# EAGLE design GMO-00058 (EAGLE 5.11)
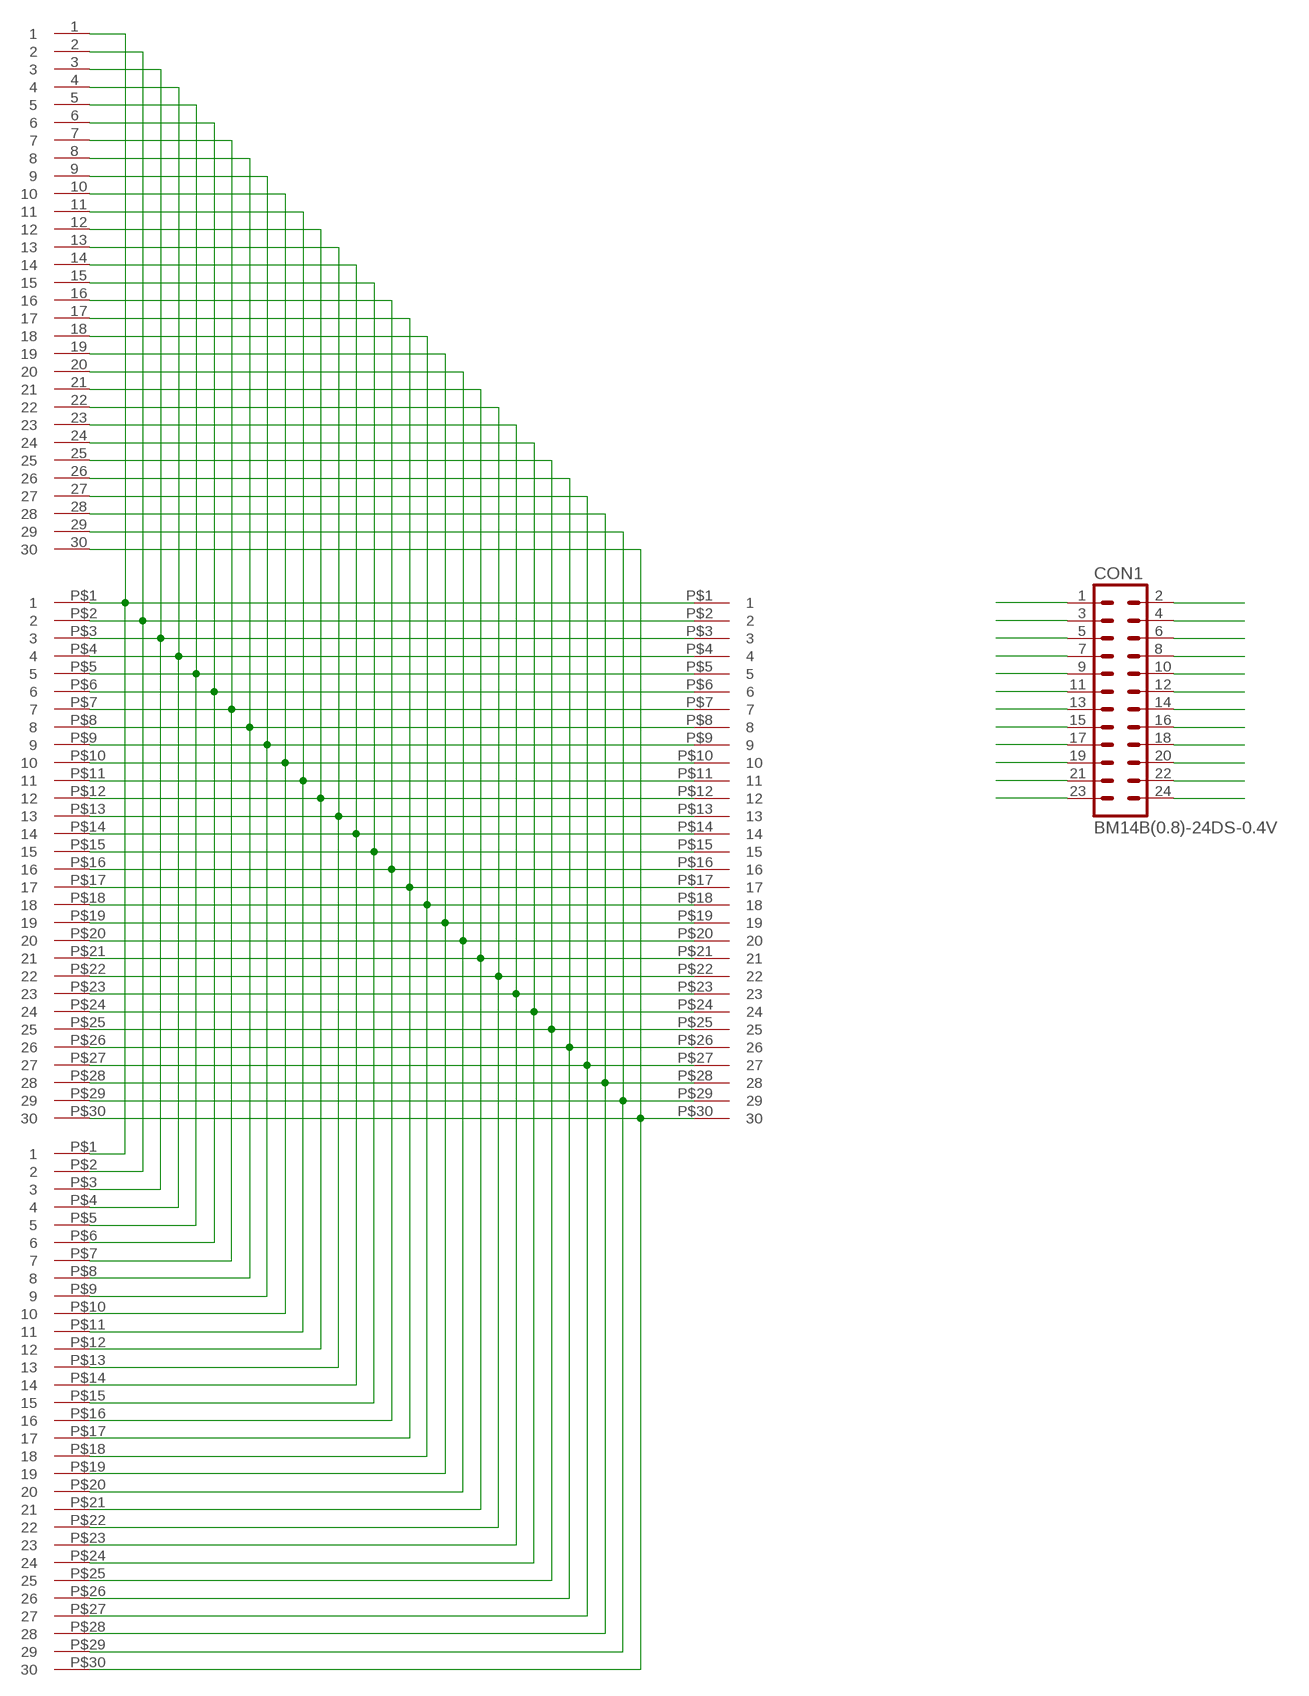
[diagram p0: schematic, sheet 1]

## Parts
CON1  BM14B(0.8)-24DS-0.4V  [BM14(0.8)-24DS-0.4V]
U$1  LCD-30PIN-15X2-PTH-BREADBOARD  [15X2-PTH-BREADBOARD]
U$2  LCD-30PIN-FPC-30-0.65  [FPC-30-0.65]
U$3  LCD-30PIN-FPC-30-1.00  [FPC-30-1.00]
U$4  LCD-30PIN-FPC-30-0.70  [FPC-30-0.70]

## Nets
N$1: CON1.1 U$1.P$1 U$2.P$1 U$3.P$1 U$4.1
N$2: CON1.2 U$1.P$2 U$2.P$2 U$3.P$2 U$4.2
N$3: CON1.3 U$1.P$3 U$2.P$3 U$3.P$3 U$4.3
N$4: CON1.4 U$1.P$4 U$2.P$4 U$3.P$4 U$4.4
N$5: CON1.5 U$1.P$5 U$2.P$5 U$3.P$5 U$4.5
N$6: CON1.6 U$1.P$6 U$2.P$6 U$3.P$6 U$4.6
N$7: CON1.7 U$1.P$7 U$2.P$7 U$3.P$7 U$4.7
N$8: CON1.8 U$1.P$8 U$2.P$8 U$3.P$8 U$4.8
N$9: CON1.9 U$1.P$9 U$2.P$9 U$3.P$9 U$4.9
N$10: CON1.10 U$1.P$10 U$2.P$10 U$3.P$10 U$4.10
N$11: CON1.11 U$1.P$11 U$2.P$11 U$3.P$11 U$4.11
N$12: CON1.12 U$1.P$12 U$2.P$12 U$3.P$12 U$4.12
N$13: CON1.13 U$1.P$13 U$2.P$13 U$3.P$13 U$4.13
N$14: CON1.14 U$1.P$14 U$2.P$14 U$3.P$14 U$4.14
N$15: CON1.15 U$1.P$15 U$2.P$15 U$3.P$15 U$4.15
N$16: CON1.16 U$1.P$16 U$2.P$16 U$3.P$16 U$4.16
N$17: CON1.17 U$1.P$17 U$2.P$17 U$3.P$17 U$4.17
N$18: CON1.18 U$1.P$18 U$2.P$18 U$3.P$18 U$4.18
N$19: CON1.19 U$1.P$19 U$2.P$19 U$3.P$19 U$4.19
N$20: CON1.20 U$1.P$20 U$2.P$20 U$3.P$20 U$4.20
N$21: CON1.21 U$1.P$21 U$2.P$21 U$3.P$21 U$4.21
N$22: CON1.22 U$1.P$22 U$2.P$22 U$3.P$22 U$4.22
N$23: CON1.23 U$1.P$23 U$2.P$23 U$3.P$23 U$4.23
N$24: CON1.24 U$1.P$24 U$2.P$24 U$3.P$24 U$4.24
N$25: U$1.P$25 U$2.P$25 U$3.P$25 U$4.25
N$26: U$1.P$26 U$2.P$26 U$3.P$26 U$4.26
N$27: U$1.P$27 U$2.P$27 U$3.P$27 U$4.27
N$28: U$1.P$28 U$2.P$28 U$3.P$28 U$4.28
N$29: U$1.P$29 U$2.P$29 U$3.P$29 U$4.29
N$30: U$1.P$30 U$2.P$30 U$3.P$30 U$4.30

## Library data of the parts
CON1 = Monkey:BM14B(0.8)-24DS-0.4V: BM14B(0.8)-24DS-0.4V
U$1-U$4 = GeekAmmo:LCD-30PIN

## Board
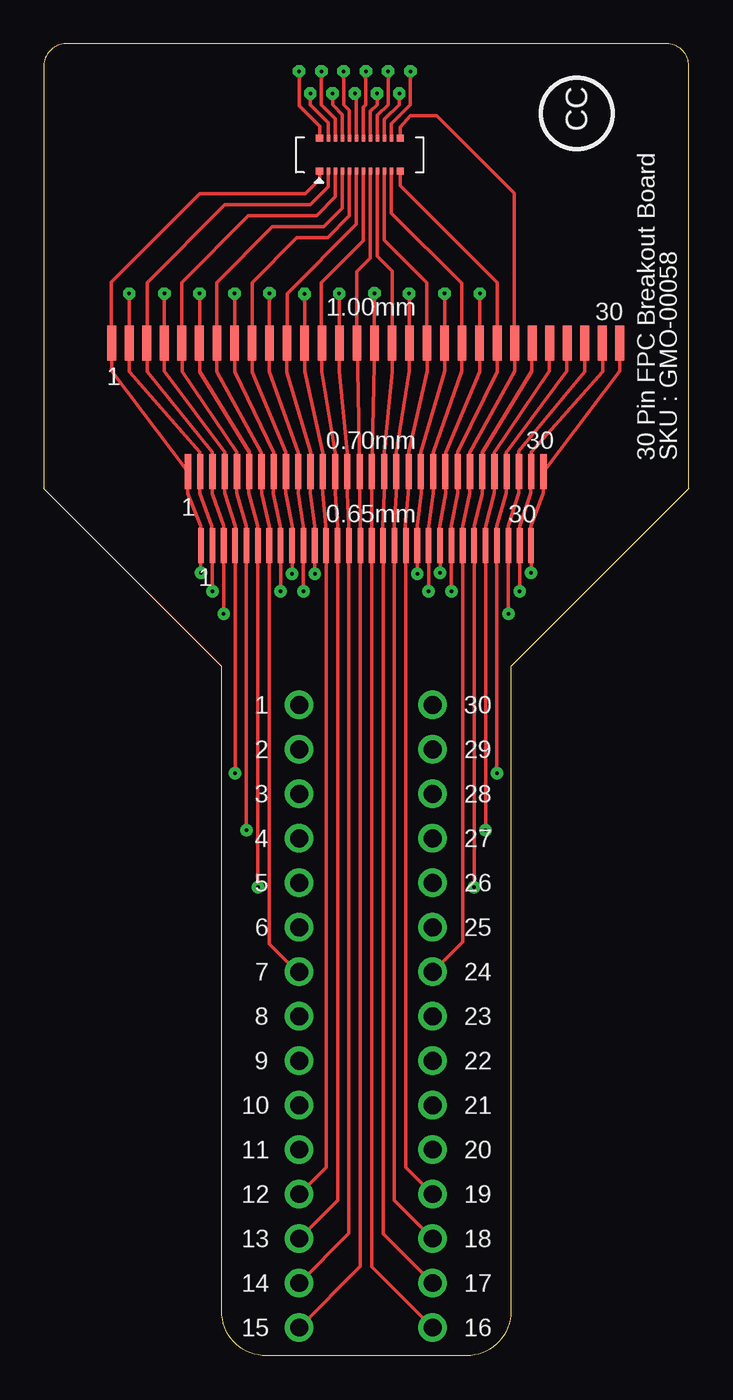
[diagram p1: board, top side]
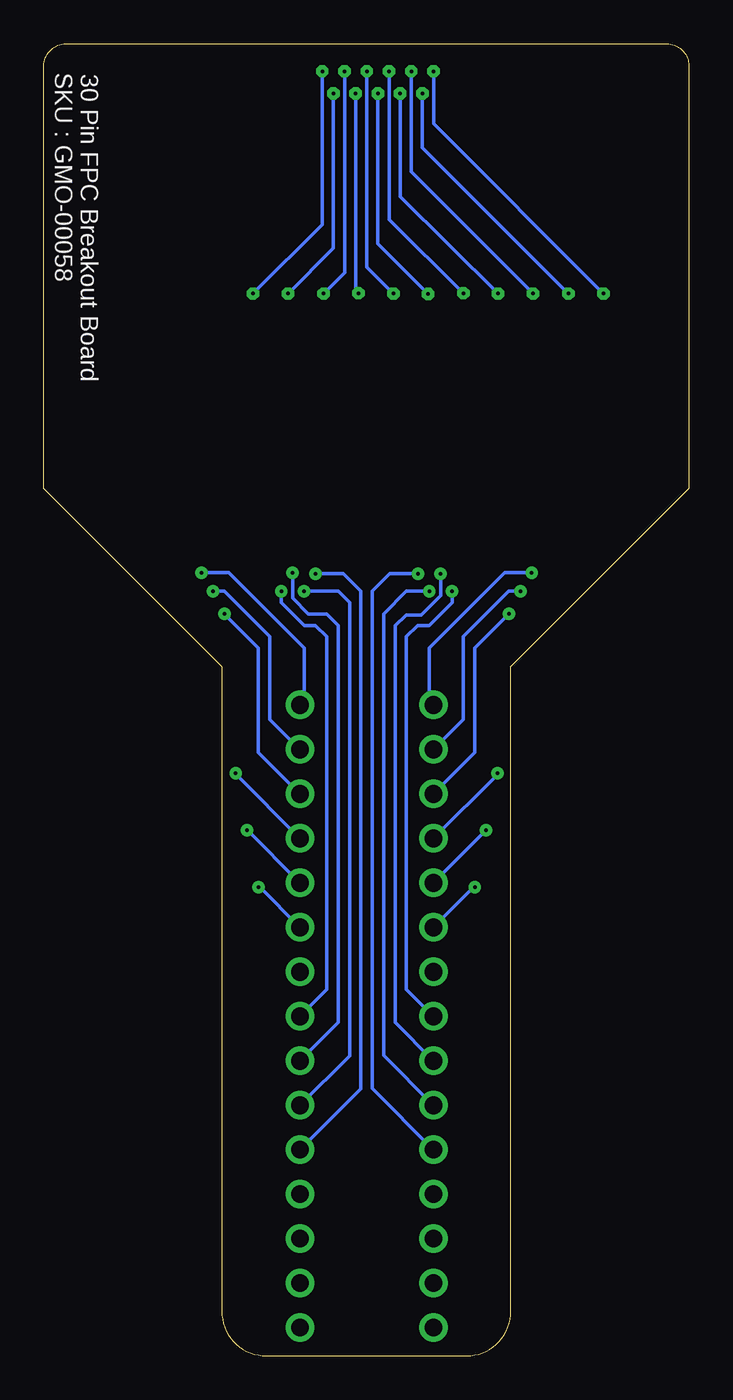
[diagram p2: board, bottom side, seen from below]

Size 36.83 x 74.93 mm. Coordinates in mm from the lower left corner, seen from the top.
Outline: 36.83,49.53 36.83,73.66 arc90 35.56,74.93 1.27,74.93 arc90 0,73.66 0,49.53 10.16,39.37 10.16,2.54 arc90 12.7,0 24.13,0 arc90 26.67,2.54 26.67,39.37 36.83,49.53
Copper layers (1*16): Top 0.035mm / dielectric 1.5mm / Bottom 0.035mm
Design rules "GeekAmmo *": minimum track width 8mil, minimum drill 0.2mm, track to track 7mil, track to pad 7mil, pad to pad 7mil, via to via 7mil, smd to smd 7mil, copper to edge 10mil, drill to drill 8mil, minimum pad ring 12mil, minimum via ring 10mil, stop-mask expansion 4mil, vias tented up to drill 25mil, thermal gap 10mil

### Footprints (pad centres in the part's own frame; a part is rotated, then mirrored left to right if it is on the bottom)
BM14(0.8)-24DS-0.4V = smd 0.41 x 0.4: 1 -0.105,0; 2 -0.105,1.88; 23 4.505,0; 24 4.505,1.88 | smd 0.2 x 0.4: 3 0.4,0; 4 0.4,1.88; 5 0.8,0; 6 0.8,1.88; 7 1.2,0; 8 1.2,1.88; 9 1.6,0; 10 1.6,1.88; 11 2,0; 12 2,1.88; 13 2.4,0; 14 2.4,1.88; 15 2.8,0; 16 2.8,1.88; 17 3.2,0; 18 3.2,1.88; 19 3.6,0; 20 3.6,1.88; 21 4,0; 22 4,1.88
15X2-PTH-BREADBOARD = drill 1.016 round: P$1 0,0; P$2 2.54,0; P$3 5.08,0; P$4 7.62,0; P$5 10.16,0; P$6 12.7,0; P$7 15.24,0; P$8 17.78,0; P$9 20.32,0; P$10 22.86,0; P$11 25.4,0; P$12 27.94,0; P$13 30.48,0; P$14 33.02,0; P$15 35.56,0; P$16 35.56,7.62; P$17 33.02,7.62; P$18 30.48,7.62; P$19 27.94,7.62; P$20 25.4,7.62; P$21 22.86,7.62; P$22 20.32,7.62; P$23 17.78,7.62; P$24 15.24,7.62; P$25 12.7,7.62; P$26 10.16,7.62; P$27 7.62,7.62; P$28 5.08,7.62; P$29 2.54,7.62; P$30 0,7.62
FPC-30-0.65 = smd 0.32 x 2: P$1 0,0; P$2 0.65,0; P$3 1.3,0; P$4 1.95,0; P$5 2.6,0; P$6 3.25,0; P$7 3.9,0; P$8 4.55,0; P$9 5.2,0; P$10 5.85,0; P$11 6.5,0; P$12 7.15,0; P$13 7.8,0; P$14 8.45,0; P$15 9.1,0; P$16 9.75,0; P$17 10.4,0; P$18 11.05,0; P$19 11.7,0; P$20 12.35,0; P$21 13,0; P$22 13.65,0; P$23 14.3,0; P$24 14.95,0; P$25 15.6,0; P$26 16.25,0; P$27 16.9,0; P$28 17.55,0; P$29 18.2,0; P$30 18.85,0
FPC-30-1.00 = smd 0.5 x 2: P$1 0,0; P$2 1,0; P$3 2,0; P$4 3,0; P$5 4,0; P$6 5,0; P$7 6,0; P$8 7,0; P$9 8,0; P$10 9,0; P$11 10,0; P$12 11,0; P$13 12,0; P$14 13,0; P$15 14,0; P$16 15,0; P$17 16,0; P$18 17,0; P$19 18,0; P$20 19,0; P$21 20,0; P$22 21,0; P$23 22,0; P$24 23,0; P$25 24,0; P$26 25,0; P$27 26,0; P$28 27,0; P$29 28,0; P$30 29,0
FPC-30-0.70 = smd 0.35 x 2: 1 0,0; 2 0.7,0; 3 1.4,0; 4 2.1,0; 5 2.8,0; 6 3.5,0; 7 4.2,0; 8 4.9,0; 9 5.6,0; 10 6.3,0; 11 7,0; 12 7.7,0; 13 8.4,0; 14 9.1,0; 15 9.8,0; 16 10.5,0; 17 11.2,0; 18 11.9,0; 19 12.6,0; 20 13.3,0; 21 14,0; 22 14.7,0; 23 15.4,0; 24 16.1,0; 25 16.8,0; 26 17.5,0; 27 18.2,0; 28 18.9,0; 29 19.6,0; 30 20.3,0

### Placement (x,y rotation side)
CON1  15.85,67.64 0 top
U$1  14.58,37.17 270 top
U$2  8.97,46.27 0 top
U$3  3.88,57.82 0 top
U$4  8.23,50.5 0 top

### Tracks (layer width: path | path; a pad name or v marks a point on that pad's centre or on a via)
N$1  (via drill 0.2)
  Top 0.203: v8.97,44.72 U$2.P$1 8.97,47.38 8.23,49.23 U$4.1 3.89,56.24 U$3.P$1 3.86,57.84 3.86,61.32 8.92,66.38 14.94,66.38 15.75,67.19 CON1.1
  Bottom 0.203: v8.97,44.72 10.52,44.72 14.82,40.42 14.82,37.41 U$1.P$1
N$2  (via drill 0.2)
  Top 0.203: v9.62,43.67 U$2.P$2 9.6,47.38 8.92,49.25 U$4.2 8.92,51.62 4.88,56.21 U$3.P$2 v4.88,60.66 | CON1.2 15.75,70.21 14.58,71.38 v14.58,73.36
  Bottom 0.203: v9.62,43.67 10.27,43.67 12.87,41.07 12.87,36.34 U$1.P$2 | v14.58,73.36 14.58,70.36 v4.88,60.66
N$3  (via drill 0.2)
  Top 0.203: v10.27,42.37 U$2.P$3 10.29,47.38 9.63,49.23 U$4.3 9.63,51.62 5.89,56.21 U$3.P$3 5.89,57.83 5.89,61.29 10.34,65.74 15.21,65.74 16.25,66.77 CON1.3
  Bottom 0.203: v10.27,42.37 12.22,40.42 12.22,34.45 U$1.P$3
N$4  (via drill 0.2)
  Top 0.203: v10.92,33.27 U$2.P$4 10.92,47.38 10.34,49.25 U$4.4 10.34,51.62 6.88,56.24 U$3.P$4 v6.88,60.66 | CON1.4 16.25,70.42 15.21,71.45 v15.21,72.09
  Bottom 0.203: v10.92,33.27 10.92,33.21 U$1.P$4 | v15.21,72.09 15.21,68.99 v6.88,60.66
N$5  (via drill 0.2)
  Top 0.203: v11.57,30.02 U$2.P$5 11.56,47.38 11.02,49.25 U$4.5 11.02,51.62 7.9,56.21 U$3.P$5 7.87,61.29 11.68,65.11 15.57,65.11 16.65,66.18 CON1.5
  Bottom 0.203: U$1.P$5 v11.57,30.02
N$6  (via drill 0.2)
  Top 0.203: v12.22,26.77 U$2.P$6 12.22,47.38 11.71,49.25 U$4.6 11.73,51.62 8.89,56.21 U$3.P$6 v8.89,60.66 | CON1.6 16.65,70.66 15.85,71.45 v15.85,73.36
  Bottom 0.203: v12.22,26.77 12.28,26.77 U$1.P$6 | v15.85,73.36 15.85,67.62 v8.89,60.66
N$7
  Top 0.203: U$1.P$7 14.46,21.93 12.87,23.52 U$2.P$7 12.88,47.38 12.45,49.23 U$4.7 12.42,51.59 9.88,56.21 U$3.P$7 9.88,61.29 13.06,64.47 15.98,64.47 17.05,65.54 CON1.7
N$8  (via drill 0.2)
  Top 0.203: v13.52,43.67 U$2.P$8 13.51,47.38 13.11,49.23 U$4.8 13.13,51.59 10.9,56.21 U$3.P$8 10.9,57.84 v10.9,60.66 | CON1.8 17.05,70.89 16.48,71.45 v16.48,72.09
  Bottom 0.203: v13.52,43.67 13.52,43.02 14.82,41.72 15.47,41.72 16.12,41.07 16.12,20.93 U$1.P$8 | v16.48,72.09 16.48,66.2 v10.9,60.66
N$9  (via drill 0.2)
  Top 0.203: v14.17,44.67 U$2.P$9 14.17,47.38 13.82,49.25 U$4.9 13.82,51.62 11.89,56.19 U$3.P$9 11.89,61.29 14.45,63.86 16.21,63.86 17.45,65.11 CON1.9
  Bottom 0.203: U$1.P$9 16.77,19.04 16.77,41.72 16.12,42.32 15.27,42.32 14.17,43.42 v14.17,44.67
N$10  (via drill 0.2)
  Top 0.203: v14.82,43.67 U$2.P$10 14.81,47.38 14.53,49.25 U$4.10 14.53,51.59 12.88,56.21 U$3.P$10 12.88,57.87 v12.88,60.68 | CON1.10 17.45,71.12 17.12,71.45 v17.12,73.36
  Bottom 0.203: v14.82,43.67 16.12,43.67 17.42,42.37 17.42,17.15 U$1.P$10 | v17.12,73.36 17.12,64.88 v12.88,60.68
N$11  (via drill 0.2)
  Top 0.203: v15.47,44.67 U$2.P$11 15.47,47.38 15.21,49.25 U$4.11 15.24,51.59 13.87,56.16 U$3.P$11 13.89,57.83 13.89,60.66 17.85,64.62 CON1.11
  Bottom 0.203: v15.47,44.67 17.07,44.67 18.07,43.67 18.07,15.26 U$1.P$11
N$12  (via drill 0.2)
  Top 0.203: U$1.P$12 16.12,10.77 U$2.P$12 16.1,47.38 15.93,49.25 U$4.12 15.93,51.59 14.89,56.24 U$3.P$12 v14.89,60.63 | CON1.12 17.85,72 v17.76,72.09
  Bottom 0.203: v17.76,72.09 17.76,63.5 v14.89,60.63
N$13
  Top 0.203: U$1.P$13 16.77,8.88 U$2.P$13 16.79,47.35 16.64,49.25 U$4.13 16.64,51.59 15.88,56.21 U$3.P$13 15.85,57.85 15.85,61.29 18.25,63.69 CON1.13
N$14  (via drill 0.2)
  Top 0.203: U$1.P$14 17.42,6.99 U$2.P$14 17.4,47.38 17.32,49.25 U$4.14 17.32,51.59 16.87,56.24 U$3.P$14 16.87,57.84 v16.87,60.66 | CON1.14 18.25,71.31 18.39,71.45 v18.39,73.36
  Bottom 0.203: v18.39,73.36 18.39,62.18 v16.87,60.66
N$15
  Top 0.203: U$1.P$15 18.07,5.1 U$2.P$15 U$4.15 U$3.P$15 17.88,61.91 18.65,62.67 CON1.15
N$16  (via drill 0.2)
  Top 0.203: U$1.P$16 18.72,5.09 U$2.P$16 U$4.16 U$3.P$16 v18.87,60.68 | CON1.16 18.65,71.08 19.02,71.45 v19.02,72.09
  Bottom 0.203: v19.02,72.09 19.02,60.84 v18.87,60.68
N$17
  Top 0.203: U$1.P$17 19.37,6.98 U$2.P$17 19.36,47.35 19.43,49.25 U$4.17 19.43,51.59 19.89,56.21 U$3.P$17 19.89,61.95 19.05,62.79 CON1.17
N$18  (via drill 0.2)
  Top 0.203: U$1.P$18 20.02,8.87 U$2.P$18 20.02,47.38 20.12,49.23 U$4.18 20.12,51.59 20.88,56.24 U$3.P$18 20.85,57.85 v20.85,60.66 | CON1.18 19.05,70.84 19.66,71.45 v19.66,73.36
  Bottom 0.203: v19.66,73.36 19.66,61.85 v20.85,60.66
N$19
  Top 0.203: U$1.P$19 20.67,10.76 U$2.P$19 20.65,47.38 20.8,49.25 U$4.19 20.83,51.62 21.89,56.24 U$3.P$19 21.87,61.29 19.45,63.72 CON1.19
N$20  (via drill 0.2)
  Top 0.203: v21.32,44.67 U$2.P$20 21.31,47.38 21.54,49.25 U$4.20 21.51,51.59 22.89,56.24 U$3.P$20 v22.89,60.66 | CON1.20 19.45,70.61 20.3,71.45 v20.3,72.09
  Bottom 0.203: v21.32,44.67 19.72,44.67 18.72,43.67 18.72,15.25 U$1.P$20 | v20.3,72.09 20.3,63.25 v22.89,60.66
N$21  (via drill 0.2)
  Top 0.203: v21.97,43.67 U$2.P$21 21.97,47.38 22.23,49.25 U$4.21 22.23,51.59 23.88,56.24 U$3.P$21 23.88,57.88 23.88,61.27 19.85,65.25 CON1.21
  Bottom 0.203: v21.97,43.67 20.02,43.67 19.37,43.02 19.37,17.14 U$1.P$21
N$22  (via drill 0.2)
  Top 0.203: v22.62,44.72 U$2.P$22 22.61,47.38 22.94,49.25 U$4.22 22.94,51.59 24.89,56.21 U$3.P$22 24.89,57.84 v24.89,60.66 | CON1.22 19.85,70.38 20.93,71.45 v20.93,73.36
  Bottom 0.203: v22.62,44.72 22.62,43.27 21.72,42.37 20.67,42.37 20.02,41.72 20.02,19.03 U$1.P$22 | v20.93,73.36 20.93,64.6 v24.89,60.66
N$23  (via drill 0.2)
  Top 0.203: v23.27,43.67 U$2.P$23 23.27,47.38 23.65,49.25 U$4.23 23.62,51.62 25.88,56.21 U$3.P$23 25.88,57.87 25.88,61.29 20.35,66.83 CON1.23
  Bottom 0.203: v23.27,43.67 23.27,43.02 21.97,41.72 21.32,41.72 20.67,41.07 20.67,20.92 U$1.P$23
N$24
  Top 0.203: U$1.P$24 23.92,23.65 U$2.P$24 23.93,47.38 24.31,49.25 U$4.24 24.33,51.59 26.9,56.24 U$3.P$24 26.85,57.86 26.85,66.4 22.43,70.82 20.93,70.82 20.35,70.16 CON1.24
N$25  (via drill 0.2)
  Top 0.203: v24.57,26.77 U$2.P$25 24.56,47.38 25.05,49.23 U$4.25 25.05,51.59 27.86,56.24 U$3.P$25
  Bottom 0.203: v24.57,26.77 24.5,26.77 U$1.P$25
N$26  (via drill 0.2)
  Top 0.203: v25.22,30.02 U$2.P$26 25.22,47.38 25.73,49.25 U$4.26 25.73,51.59 28.86,56.24 U$3.P$26
  Bottom 0.203: v25.22,30.02 v25.21,30.02 U$1.P$26
N$27  (via drill 0.2)
  Top 0.203: v25.87,33.27 U$2.P$27 25.86,47.38 26.42,49.25 U$4.27 26.42,51.59 29.87,56.24 U$3.P$27
  Bottom 0.203: v25.87,33.27 25.87,33.22 U$1.P$27
N$28  (via drill 0.2)
  Top 0.203: v26.52,42.37 U$2.P$28 26.52,47.38 27.13,49.25 U$4.28 27.13,51.67 30.89,56.21 U$3.P$28
  Bottom 0.203: v26.52,42.37 24.57,40.42 24.57,34.46 U$1.P$28
N$29  (via drill 0.2)
  Top 0.203: v27.17,43.67 U$2.P$29 27.18,47.38 27.81,49.25 U$4.29 27.84,51.62 31.9,56.21 U$3.P$29
  Bottom 0.203: v27.17,43.67 26.52,43.67 23.92,41.07 23.92,36.35 U$1.P$29
N$30  (via drill 0.2)
  Top 0.203: v27.82,44.72 U$2.P$30 27.81,47.35 28.53,49.25 U$4.30 32.89,56.24 U$3.P$30
  Bottom 0.203: v27.82,44.72 26.27,44.72 21.97,40.42 21.97,37.4 U$1.P$30

### Text on the board
tPlace: CC | 1.00mm | 0.70mm | 30 Pin FPC Breakout Board | SKU : GMO-00058 | 0.65mm | 1 | 30 | 2 | 29 | 3 | 28 | 4 | 27 | 5 | 26 | 6 | 25 | 7 | 24 | 8 | 23 | 9 | 22 | 10 | 21 | 11 | 20 | 12 | 19 | 13 | 18 | 14 | 17 | 15 | 16
bPlace: 30 Pin FPC Breakout Board | SKU : GMO-00058